# EAGLE schematic untitled (EAGLE 6.1)
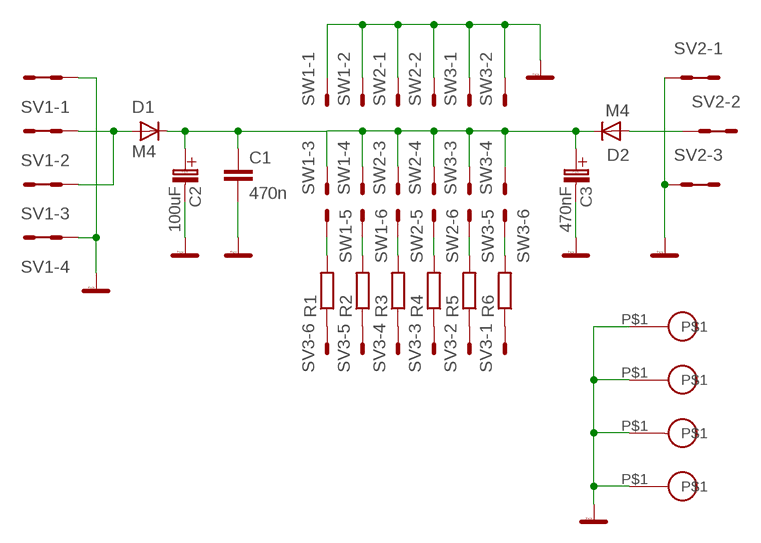
[diagram p0: schematic, sheet 1]

## Parts
C1  470n  C-EUC0805  [C0805]
C2  100uF  1M/50V  [C]
C3  470nF  1M/50V  [C]
D1  M4  D-OB.SMA  [SMA]
D2  M4  D-OB.SMA  [SMA]
R1  R0805  [0805]
R2  R0805  [0805]
R3  R0805  [0805]
R4  R0805  [0805]
R5  R0805  [0805]
R6  R0805  [0805]
SV1  MA04-2  [MA04-2]
SV2  MA03-2  [MA03-2]
SV3  MA06-1  [MA06-1]
SW1  MA03-3  [MA03-2]
SW2  MA03-3  [MA03-2]
SW3  MA03-3  [MA03-2]
X1  SROUB3M  [SROUB3M]
X2  SROUB3M  [SROUB3M]
X3  SROUB3M  [SROUB3M]
X4  SROUB3M  [SROUB3M]

## Nets
GND: C1.2 C2.-(C_EL-) C3.-(C_EL-) SV1.1 SV1.2 SV1.7 SV1.8 SV2.1 SV2.2 SV2.5 SV2.6 SW1.1 SW1.2 SW2.1 SW2.2 SW3.1 SW3.2 X1.P$1 X2.P$1 X3.P$1 X4.P$1
N$1: R1.1 SV3.6
N$2: D1.A SV1.3 SV1.4 SV1.5 SV1.6
N$3: R2.1 SV3.5
N$4: R3.1 SV3.4
N$5: C1.1 C2.+(C_EL+) C3.+(C_EL+) D1.K(C) D2.K(C) SW1.3 SW1.4 SW2.3 SW2.4 SW3.3 SW3.4
N$6: R4.1 SV3.3
N$7: D2.A SV2.3 SV2.4
N$8: R5.1 SV3.2
N$9: R6.1 SV3.1
N$10: R1.2 SW1.5
N$11: R2.2 SW1.6
N$12: R3.2 SW2.5
N$13: R4.2 SW2.6
N$14: R5.2 SW3.5
N$15: R6.2 SW3.6

## Library data of the parts
C1 = rcl:C-EU: CAPACITOR, European symbol
C2 C3 = PaJa_C-tantal_SMD:1M/50V
D1 D2 = moje:D-OB.SMA: SMA
R1-R6 = moje_R:R0805
SV1 = moje_hrebinky:MA04-2: PIN HEADER; OC_FARNELL: unknown; OC_NEWARK: unknown
SV2 = moje_hrebinky:MA03-2: PIN HEADER; OC_FARNELL: unknown; OC_NEWARK: unknown
SV3 = moje_hrebinky:MA06-1: PIN HEADER; OC_FARNELL: unknown; OC_NEWARK: unknown
SW1-SW3 = moje_hrebinky:MA03-3
X1-X4 = moje:SROUB3M